# Altium schematic sheet Micro_USB.SchDoc: Conexión Micro-USB
size A4; Author: **; CompanyName: Introducción al Diseño de Circuitos Impresos; Organization: UTN FRBA; DocumentNumber: 8; Revision: 01; SheetNumber: 8; SheetTotal: 9; Autor: Eugenia Ipar
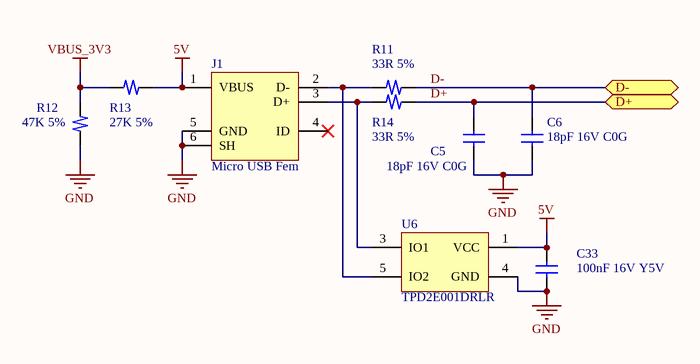
[diagram p0: Micro_USB.SchDoc]

## Parts
C5  18pF 16V C0G  [C_0402]
C6  18pF 16V C0G  [C_0402]
C33  100nF 16V Y5V  [C_0402]
J1  Micro USB Fem  [Micro USB]
R11  33R 5%  [R_0402]
R12  47K 5%  [R_0402]
R13  27K 5%  [R_0402]
R14  33R 5%  [R_0402]
U6  TPD2E001DRLR  [TPD2E001]

## Ports
D+ (bidir), D- (bidir)

## Nets
5V: C33.1 J1.1(VBUS) R13.2 U6.1(VCC)
GND: C5.2 C6.2 C33.2 J1.5(GND) J1.6(SH) R12.1 U6.4(GND)
VBUS_3V3: R12.2 R13.1
D+: C5.1 R14.2 ; port D+
D-: C6.1 R11.2 ; port D-
NetJ1_2: J1.2(D-) R11.1 U6.5(IO2)
NetJ1_3: J1.3(D+) R14.1 U6.3(IO1)

Not connected (* = marked no-connect by the designer): J1 4(ID)*

## Notes on the sheet
- Title:
- Size:
- Author:
- A4
- Sheet
- of
- Revision:
- File:
- Date:

## Library data of the parts
C5 C6 C33 = Ceramic Capacitor: Ceramic Capacitor SMD 0402
J1 = Micro USB Connector: Micro-USB 2.0 AB Receptacle, Right Angle, Part Number 47590-0001
R11-R14 = Resistor: Resistor SMD 0402
U6 = Diode ESD-Protection: Low-Capacitance 2-Ch ESD-Protection for High-Speed Data Interfaces, SOT5